# EAGLE design OpampTestBoard (EAGLE 6.5.0)
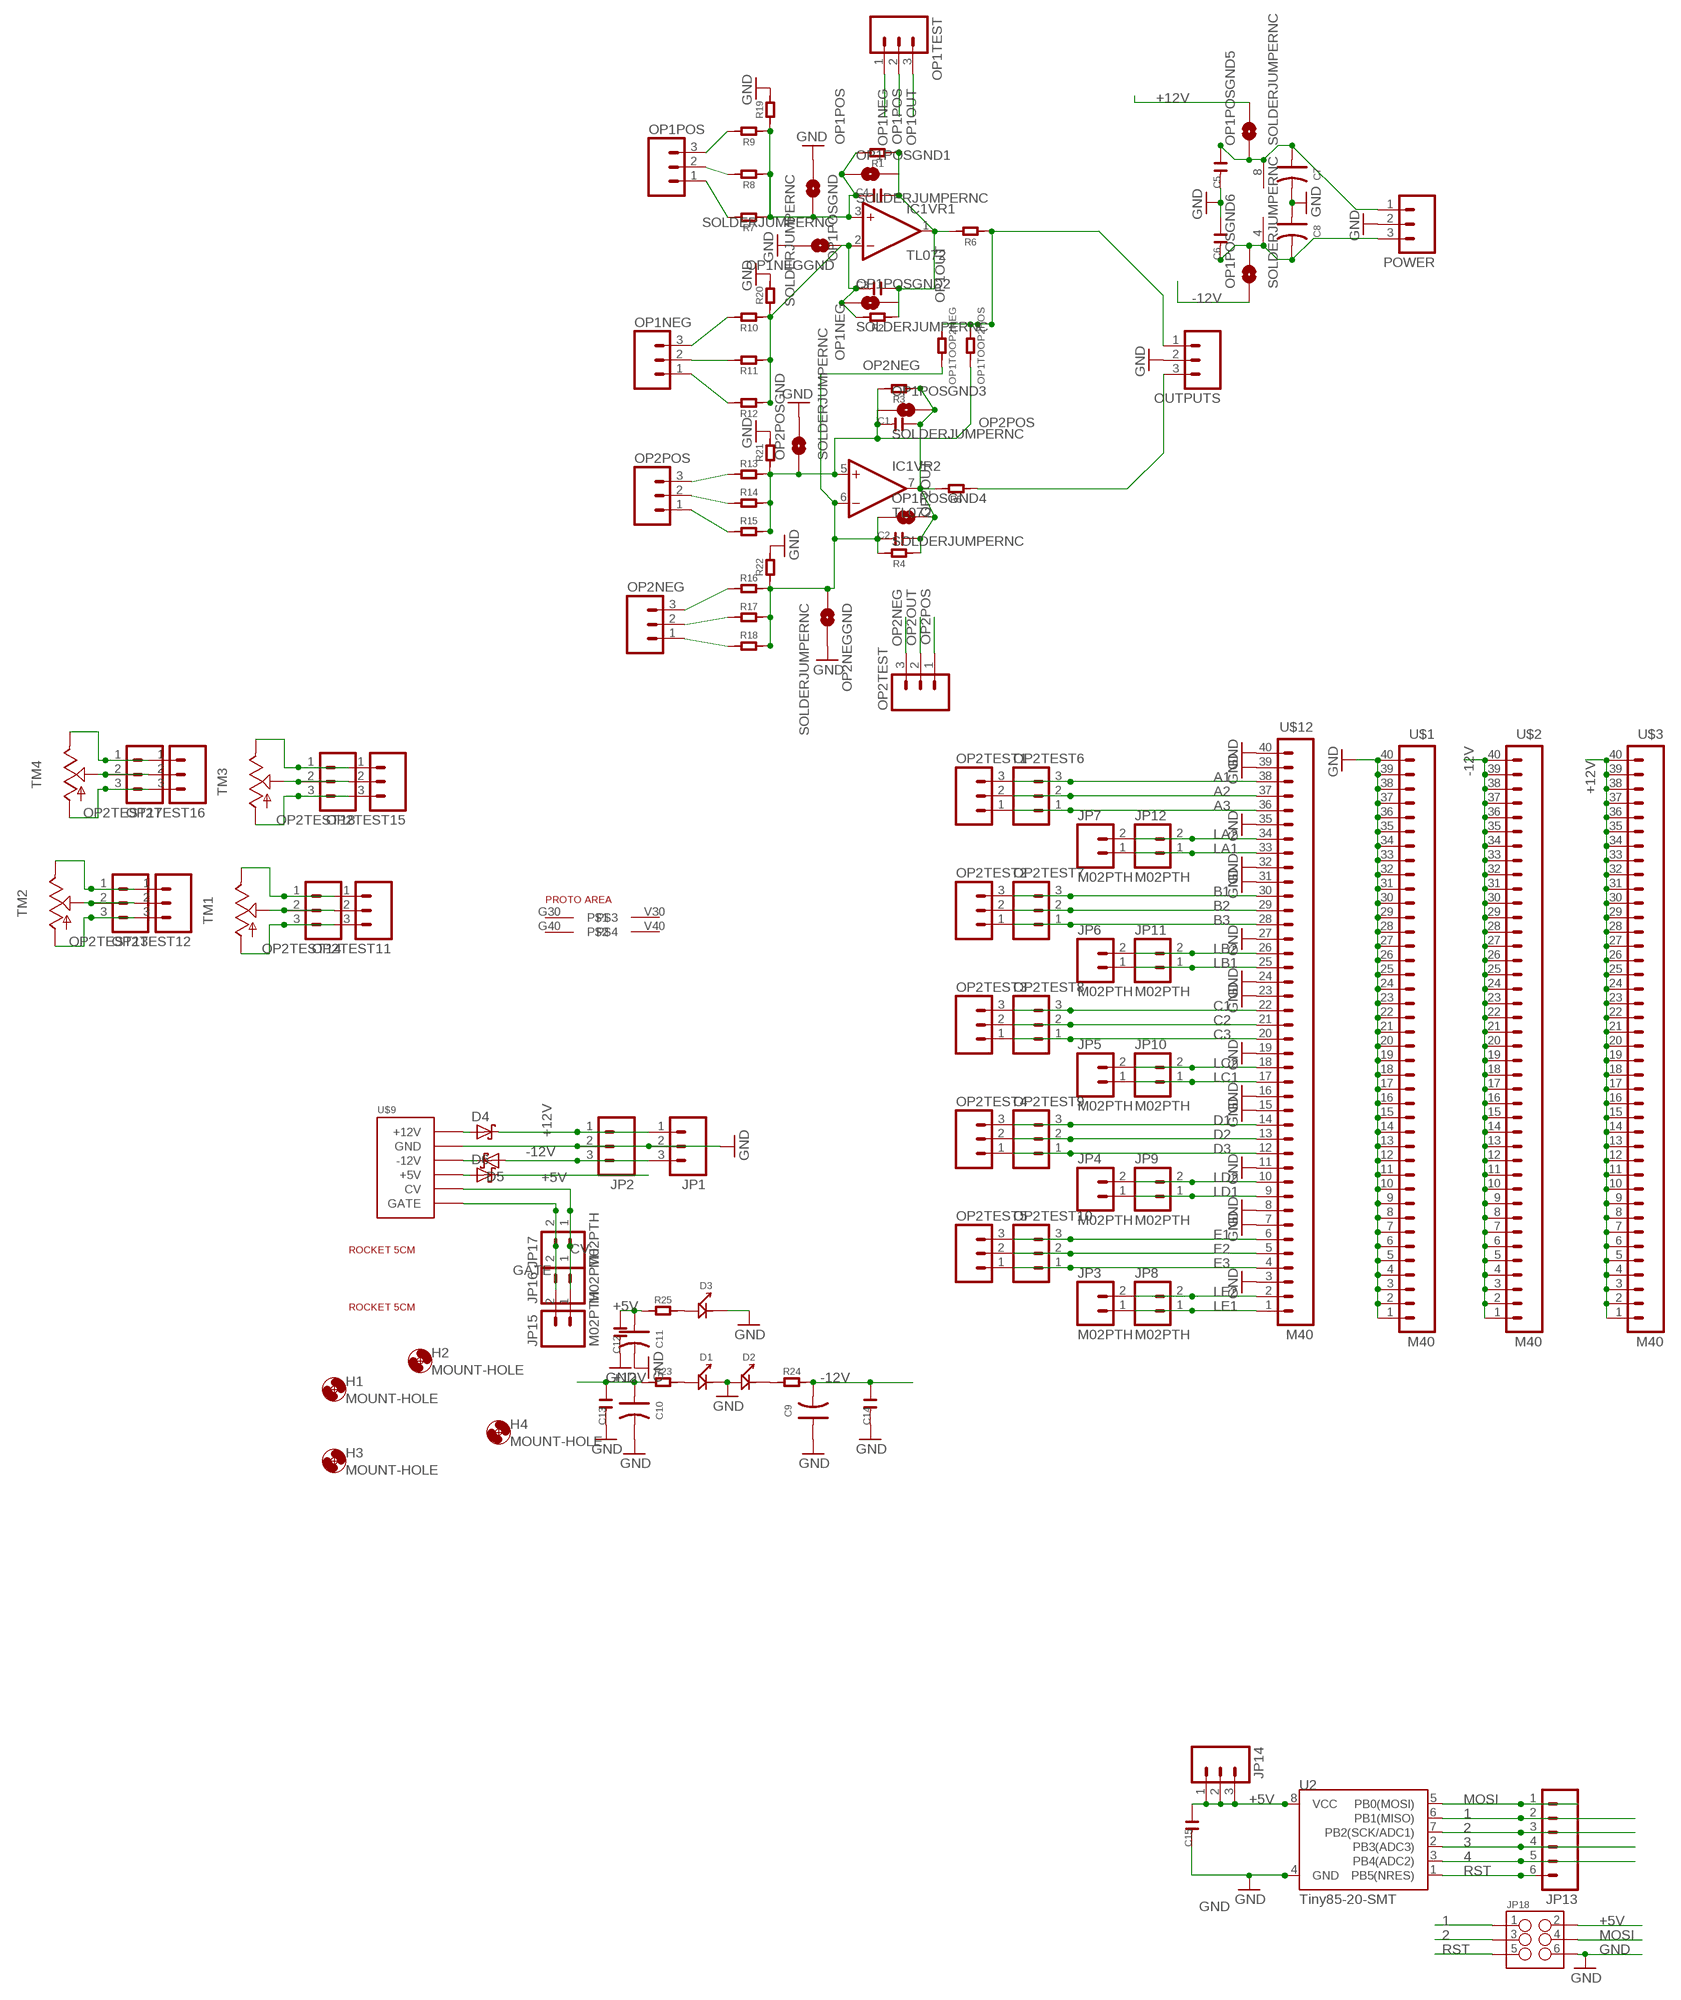
[diagram p0: schematic, sheet 1]

## Parts
C1  C-0805  [C0805]
C2  C-0805  [C0805]
C3  C-0805  [C0805]
C4  C-0805  [C0805]
C5  C-0805  [C0805]
C6  C-0805  [C0805]
C7  C-POLAR-A  [AVX-A]
C8  C-POLAR-A  [AVX-A]
C9  C-POLAR-A  [AVX-A]
C10  C-POLAR-A  [AVX-A]
C11  C-POLAR-A  [AVX-A]
C12  C-0805  [C0805]
C13  C-0805  [C0805]
C14  C-0805  [C0805]
C15  C-0603  [C0603]
D1  LED  [LED0603]
D2  LED  [LED0603]
D3  LED  [LED0603]
D4  SCHOTTKY-DIODEDO41  [DO41-10]
D5  SCHOTTKY-DIODEDO41  [DO41-10]
D6  SCHOTTKY-DIODEDO41  [DO41-10]
H1  MOUNT-HOLE  [3.2-NOMARKINGS-SMALLSAFEZONE]
H2  MOUNT-HOLE  [3.2-NOMARKINGS-SMALLSAFEZONE]
H3  MOUNT-HOLE  [3.2-NOMARKINGS-SMALLSAFEZONE]
H4  MOUNT-HOLE  [3.2-NOMARKINGS-SMALLSAFEZONE]
IC1  TL072  [SO08]
JP1  M03PTH  [1X03]
JP2  M03PTH  [1X03]
JP3  M02PTH  [1X02]
JP4  M02PTH  [1X02]
JP5  M02PTH  [1X02]
JP6  M02PTH  [1X02]
JP7  M02PTH  [1X02]
JP8  M02PTH  [1X02]
JP9  M02PTH  [1X02]
JP10  M02PTH  [1X02]
JP11  M02PTH  [1X02]
JP12  M02PTH  [1X02]
JP13  M06SIP  [1X06]
JP14  M03PTH  [1X03]
JP15  M02PTH  [1X02]
JP16  M02PTH  [1X02]
JP17  M02PTH  [1X02]
JP18  M03X2SMT  [2X3_SMT_POSTS]
OP1NEG  M03PTH  [1X03]
OP1NEGGND  SOLDERJUMPERNC  [SJ_2S]
OP1POS  M03PTH  [1X03]
OP1POSGND  SOLDERJUMPERNC  [SJ_2S]
OP1POSGND1  SOLDERJUMPERNC  [SJ_2S]
OP1POSGND2  SOLDERJUMPERNC  [SJ_2S]
OP1POSGND3  SOLDERJUMPERNC  [SJ_2S]
OP1POSGND4  SOLDERJUMPERNC  [SJ_2S]
OP1POSGND5  SOLDERJUMPERNC  [SJ_2S]
OP1POSGND6  SOLDERJUMPERNC  [SJ_2S]
OP1TEST  M03PTH  [1X03]
OP1TOOP2NEG  R-0603  [R0603]
OP1TOOP2POS  R-0603  [R0603]
OP2NEG  M03PTH  [1X03]
OP2NEGGND  SOLDERJUMPERNC  [SJ_2S]
OP2POS  M03PTH  [1X03]
OP2POSGND  SOLDERJUMPERNC  [SJ_2S]
OP2TEST  M03PTH  [1X03]
OP2TEST1  M03PTH  [1X03]
OP2TEST2  M03PTH  [1X03]
OP2TEST3  M03PTH  [1X03]
OP2TEST4  M03PTH  [1X03]
OP2TEST5  M03PTH  [1X03]
OP2TEST6  M03PTH  [1X03]
OP2TEST7  M03PTH  [1X03]
OP2TEST8  M03PTH  [1X03]
OP2TEST9  M03PTH  [1X03]
OP2TEST10  M03PTH  [1X03]
OP2TEST11  M03PTH  [1X03]
OP2TEST12  M03PTH  [1X03]
OP2TEST13  M03PTH  [1X03]
OP2TEST14  M03PTH  [1X03]
OP2TEST15  M03PTH  [1X03]
OP2TEST16  M03PTH  [1X03]
OP2TEST17  M03PTH  [1X03]
OP2TEST18  M03PTH  [1X03]
OUTPUTS  M03PTH  [1X03]
POWER  M03PTH  [1X03]
R1  R-0603  [R0603]
R2  R-0603  [R0603]
R3  R-0603  [R0603]
R4  R-0603  [R0603]
R5  R-0603  [R0603]
R6  R-0603  [R0603]
R7  R-0603  [R0603]
R8  R-0603  [R0603]
R9  R-0603  [R0603]
R10  R-0603  [R0603]
R11  R-0603  [R0603]
R12  R-0603  [R0603]
R13  R-0603  [R0603]
R14  R-0603  [R0603]
R15  R-0603  [R0603]
R16  R-0603  [R0603]
R17  R-0603  [R0603]
R18  R-0603  [R0603]
R19  R-0603  [R0603]
R20  R-0603  [R0603]
R21  R-0603  [R0603]
R22  R-0603  [R0603]
R23  R-0603  [R0603]
R24  R-0603  [R0603]
R25  R-0603  [R0603]
TM1  TRIM  [6MM]
TM2  TRIM  [6MM]
TM3  TRIM  [6MM]
TM4  TRIM  [6MM]
U2  Tiny85-20-SMT  ATTINY45TINY85-20-SMT  [SO08-EIAJ]
U$1  M40  [1X40]
U$2  M40  [1X40]
U$3  M40  [1X40]
U$9  POWER  [POWER_16]
U$10  ROCKET-5CM  [ROCKET-5CM]
U$12  M40  [1X40]
U$17  ROCKET-5CM  [ROCKET-5CM]
U$32  PROTOAREA  [PROTO_10_24]

## Nets
1: JP13.2 JP18.1 U2.6(PB1(MISO))
2: JP13.3 JP18.3 U2.7(PB2(SCK/ADC1))
3: JP13.4 U2.2(PB3(ADC3))
4: JP13.5 U2.3(PB4(ADC2))
+5V: C11.+ C12.2 C15.2 D6.C JP14.1 JP14.2 JP14.3 JP18.2 R25.1 U2.8(VCC)
+12V: C10.+ C13.2 D4.C JP1.1 JP2.1 OP1POSGND5.2 R23.1 U$3.1 U$3.2 U$3.3 U$3.4 U$3.5 U$3.6 U$3.7 U$3.8 U$3.9 U$3.10 U$3.11 U$3.12 U$3.13 U$3.14 U$3.15 U$3.16 U$3.17 U$3.18 U$3.19 U$3.20 U$3.21 U$3.22 U$3.23 U$3.24 U$3.25 U$3.26 U$3.27 U$3.28 U$3.29 U$3.30 U$3.31 U$3.32 U$3.33 U$3.34 U$3.35 U$3.36 U$3.37 U$3.38 U$3.39 U$3.40
-12V: C9.- C14.2 D5.A JP1.3 JP2.3 OP1POSGND6.1 R24.2 U$2.1 U$2.2 U$2.3 U$2.4 U$2.5 U$2.6 U$2.7 U$2.8 U$2.9 U$2.10 U$2.11 U$2.12 U$2.13 U$2.14 U$2.15 U$2.16 U$2.17 U$2.18 U$2.19 U$2.20 U$2.21 U$2.22 U$2.23 U$2.24 U$2.25 U$2.26 U$2.27 U$2.28 U$2.29 U$2.30 U$2.31 U$2.32 U$2.33 U$2.34 U$2.35 U$2.36 U$2.37 U$2.38 U$2.39 U$2.40
A1: OP2TEST1.3 OP2TEST6.3 U$12.38
A2: OP2TEST1.2 OP2TEST6.2 U$12.37
A3: OP2TEST1.1 OP2TEST6.1 U$12.36
B1: OP2TEST2.3 OP2TEST7.3 U$12.30
B2: OP2TEST2.2 OP2TEST7.2 U$12.29
B3: OP2TEST2.1 OP2TEST7.1 U$12.28
C1: OP2TEST3.3 OP2TEST8.3 U$12.22
C2: OP2TEST3.2 OP2TEST8.2 U$12.21
C3: OP2TEST3.1 OP2TEST8.1 U$12.20
CV: JP15.1 JP16.1 JP17.1 U$9.13(CV) U$9.14(CV)
D1: OP2TEST4.3 OP2TEST9.3 U$12.14
D2: OP2TEST4.2 OP2TEST9.2 U$12.13
D3: OP2TEST4.1 OP2TEST9.1 U$12.12
E1: OP2TEST5.3 OP2TEST10.3 U$12.6
E2: OP2TEST5.2 OP2TEST10.2 U$12.5
E3: OP2TEST5.1 OP2TEST10.1 U$12.4
GATE: JP15.2 JP16.2 JP17.2 U$9.15(GATE) U$9.16(GATE)
GND: C5.1 C6.2 C7.- C8.+ C9.+ C10.- C11.- C12.1 C13.1 C14.1 C15.1 D1.- D2.+ D3.- JP1.2 JP2.2 JP18.6 OP1NEGGND.2 OP1POSGND.1 OP2NEGGND.2 OP2POSGND.2 OUTPUTS.2 POWER.2 R19.2 R20.2 R21.2 R22.2 U2.4(GND) U$1.1 U$1.2 U$1.3 U$1.4 U$1.5 U$1.6 U$1.7 U$1.8 U$1.9 U$1.10 U$1.11 U$1.12 U$1.13 U$1.14 U$1.15 U$1.16 U$1.17 U$1.18 U$1.19 U$1.20 U$1.21 U$1.22 U$1.23 U$1.24 U$1.25 U$1.26 U$1.27 U$1.28 U$1.29 U$1.30 U$1.31 U$1.32 U$1.33 U$1.34 U$1.35 U$1.36 U$1.37 U$1.38 U$1.39 U$1.40 U$9.3(GND) U$9.4(GND) U$9.5(GND) U$9.6(GND) U$9.7(GND) U$9.8(GND) U$12.3 U$12.7 U$12.8 U$12.11 U$12.15 U$12.16 U$12.19 U$12.23 U$12.24 U$12.27 U$12.31 U$12.32 U$12.35 U$12.39 U$12.40
LA1: JP7.1 JP12.1 U$12.33
LA2: JP7.2 JP12.2 U$12.34
LB1: JP6.1 JP11.1 U$12.25
LB2: JP6.2 JP11.2 U$12.26
LC1: JP5.1 JP10.1 U$12.17
LC2: JP5.2 JP10.2 U$12.18
LD1: JP4.1 JP9.1 U$12.9
LD2: JP4.2 JP9.2 U$12.10
LE1: JP3.1 JP8.1 U$12.1
LE2: JP3.2 JP8.2 U$12.2
MOSI: JP13.1 JP18.4 U2.5(PB0(MOSI))
N$1: OP1POS.3 R9.2
N$2: OP1TOOP2NEG.1 OP1TOOP2POS.1 OUTPUTS.1 R6.1
N$3: OP1POS.2 R8.2
N$4: OUTPUTS.3 R5.1
N$5: OP2TEST11.2 OP2TEST14.2 TM1.S
N$6: OP2TEST12.2 OP2TEST13.2 TM2.S
N$7: OP1POS.1 R7.2
N$8: OP1NEG.3 R10.2
N$9: OP1NEG.2 R11.2
N$10: OP1NEG.1 R12.2
N$11: OP2POS.3 R13.1
N$12: OP2POS.2 R14.1
N$13: OP2POS.1 R15.1
N$14: OP2NEG.3 R16.1
N$15: OP2NEG.2 R17.1
N$16: OP2NEG.1 R18.1
N$17: OP2TEST12.1 OP2TEST13.1 TM2.E
N$18: D3.+ R25.2
N$19: D1.+ R23.2
N$20: D2.- R24.1
N$21: OP2TEST12.3 OP2TEST13.3 TM2.A
N$22: OP2TEST11.1 OP2TEST14.1 TM1.E
N$23: OP2TEST11.3 OP2TEST14.3 TM1.A
N$24: OP2TEST15.2 OP2TEST18.2 TM3.S
N$25: OP2TEST16.2 OP2TEST17.2 TM4.S
N$26: OP2TEST16.1 OP2TEST17.1 TM4.E
N$27: OP2TEST16.3 OP2TEST17.3 TM4.A
N$28: OP2TEST15.1 OP2TEST18.1 TM3.E
N$29: OP2TEST15.3 OP2TEST18.3 TM3.A
N$30: D4.A U$9.9(+12V) U$9.10(+12V)
N$31: D5.C U$9.1(-12V) U$9.2(-12V)
N$32: D6.A U$9.11(+5V) U$9.12(+5V)
OP1NEG: C3.1 IC1.2(VR1:-IN) OP1NEGGND.1 OP1POSGND2.1 OP1TEST.1 R2.2 R10.1 R11.1 R12.1 R20.1
OP1OUT: C3.2 C4.2 IC1.1(VR1:OUT) OP1POSGND1.2 OP1POSGND2.2 OP1TEST.3 R1.1 R2.1 R6.2
OP1POS: C4.1 IC1.3(VR1:+IN) OP1POSGND1.1 OP1POSGND.2 OP1TEST.2 R1.2 R7.1 R8.1 R9.1 R19.1
OP2NEG: C2.1 IC1.6(VR2:-IN) OP1POSGND4.1 OP1TOOP2NEG.2 OP2NEGGND.1 OP2TEST.3 R4.2 R16.2 R17.2 R18.2 R22.1
OP2OUT: C1.2 C2.2 IC1.7(VR2:OUT) OP1POSGND3.2 OP1POSGND4.2 OP2TEST.2 R3.1 R4.1 R5.2
OP2POS: C1.1 IC1.5(VR2:+IN) OP1POSGND3.1 OP1TOOP2POS.2 OP2POSGND.1 OP2TEST.1 R3.2 R13.2 R14.2 R15.2 R21.1
RST: JP13.6 JP18.5 U2.1(PB5(NRES))
VNEG: C6.1 C8.- IC1.4(VR3:V-) OP1POSGND6.2 POWER.3
VPOS: C5.2 C7.+ IC1.8(VR3:V+) OP1POSGND5.1 POWER.1
Unconnected: U$32.G30 U$32.G40 U$32.V30 U$32.V40

## Library data of the parts
C1-C6 C12-C15 = OPL:C*
C7-C11 = OPL:C-POLAR*
D1-D3 = OPL:LED*: LED
D4-D6 = adafruit:SCHOTTKY-DIODE: Schottky Diode
H1-H4 = zephod-components:MOUNT-HOLE: MOUNTING HOLE with drill center marker
IC1 = EurorackModularParts:TL072
JP1 JP2 JP14 OP1NEG OP1POS OP1TEST OP2NEG OP2POS OP2TEST OP2TEST1-OP2TEST18 OUTPUTS POWER = SparkFun-Connectors:M03: Header 3 Standard 3-pin 0.1" header. Use with straight break away headers (SKU : PRT-00116), right angle break away headers (PRT-00553), swiss pins (PRT-00743), machine pins (PRT-00117), and female headers (PRT-00115). Molex polarized connector foot print use with SKU : PRT-08232 with associated crimp pins and housings.
JP3-JP12 JP15-JP17 = SparkFun-Connectors:M02: Standard 2-pin 0.1" header. Use with - straight break away headers ( PRT-00116) - right angle break away headers (PRT-00553) - swiss pins (PRT-00743) - machine pins (PRT-00117) - female headers (PRT-00115) Molex polarized connector foot print use with: PRT-08233 with associated crimp pins and housings. 2.54_SCREWTERM for use with PRT-10571. 3.5mm Screw Terminal footprints for PRT-08084 5mm Screw Terminal footprints for use with PRT-08433
JP13 = zephod-components:M06: Header 6 Standard 6-pin 0.1" header. Use with straight break away headers (SKU : PRT-00116), right angle break away headers (PRT-00553), swiss pins (PRT-00743), machine pins (PRT-00117), and female headers (PRT-00115). Molex polarized connector foot print use with SKU : PRT-08094 with associated crimp pins and housings. NOTES ON THE VARIANTS LOCK and LOCK_LONGPADS... This footprint was designed to help hold the alignment of a through-hole component (i.e. 6-pin header) while soldering it into place. You may notice that each hole has been shifted either up or down by 0.005 of an inch from it's more standard position (which is a perfectly straight line). This slight alteration caused the pins (the squares in the middle) to touch the edges of the holes. Because they are alternating, it causes a "brace" to hold the component in place. 0.005 has proven to be the perfect amount of "off-center" position when using our standard breakaway headers. Although looks a little odd when you look at the bare footprint, once you have a header in there, the alteration is very hard to notice. Also,if you push a header all the way into place, it is covered up entirely on the bottom side. This idea of altering the position of holes to aid alignment will be further integrated into the Sparkfun Library for other footprints. It can help hold any component with 3 or more connection pins.
JP18 = zephod-components:M03X2: 2x3 .1" header. Shrouded, with keying- CONN-10681 SMT- CONN-11415 Pogo pins- HW-11044; PROD_ID: CONN-11415
OP1NEGGND OP1POSGND OP1POSGND1-OP1POSGND6 OP2NEGGND OP2POSGND = SparkFun-Passives:SOLDERJUMPER: Solder Jumper Standard SMD solder jumper. Used to automate production. Two varients : Normally Open and Normally Closed are the same, but have different paste layers. NC will have a large amount of paste and should jumper during reflow.
OP1TOOP2NEG OP1TOOP2POS R1-R25 = OPL:R*
TM1-TM4 = adafruit:TRIM
U2 = SparkFun-DigitalIC:ATTINY45: Atmel 8-pin 2/4/8kB flash uC; PROD_ID: IC-09092
U$1-U$3 U$12 = SparkFun-Connectors:M40: 1x40 .1" header
U$9 = EurorackModularParts:POWER
U$10 U$17 = zephod-components:ROCKET-5CM
U$32 = DP_protoboard:PROTOAREA

## Net classes
0 default: width 0.381 mm
1 POWER: width 0.406 mm

## Board
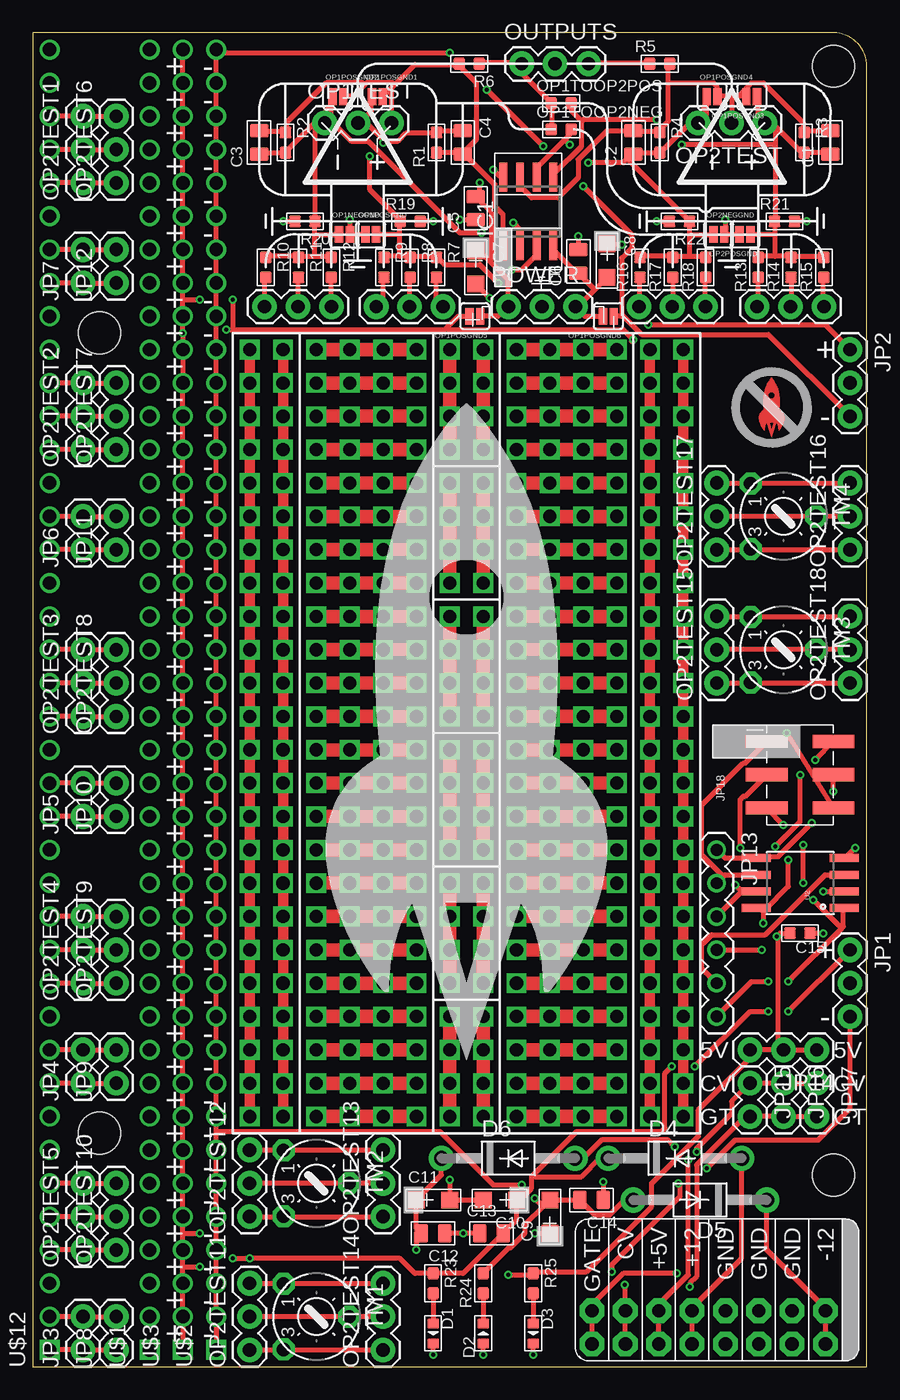
[diagram p1: board, top side]
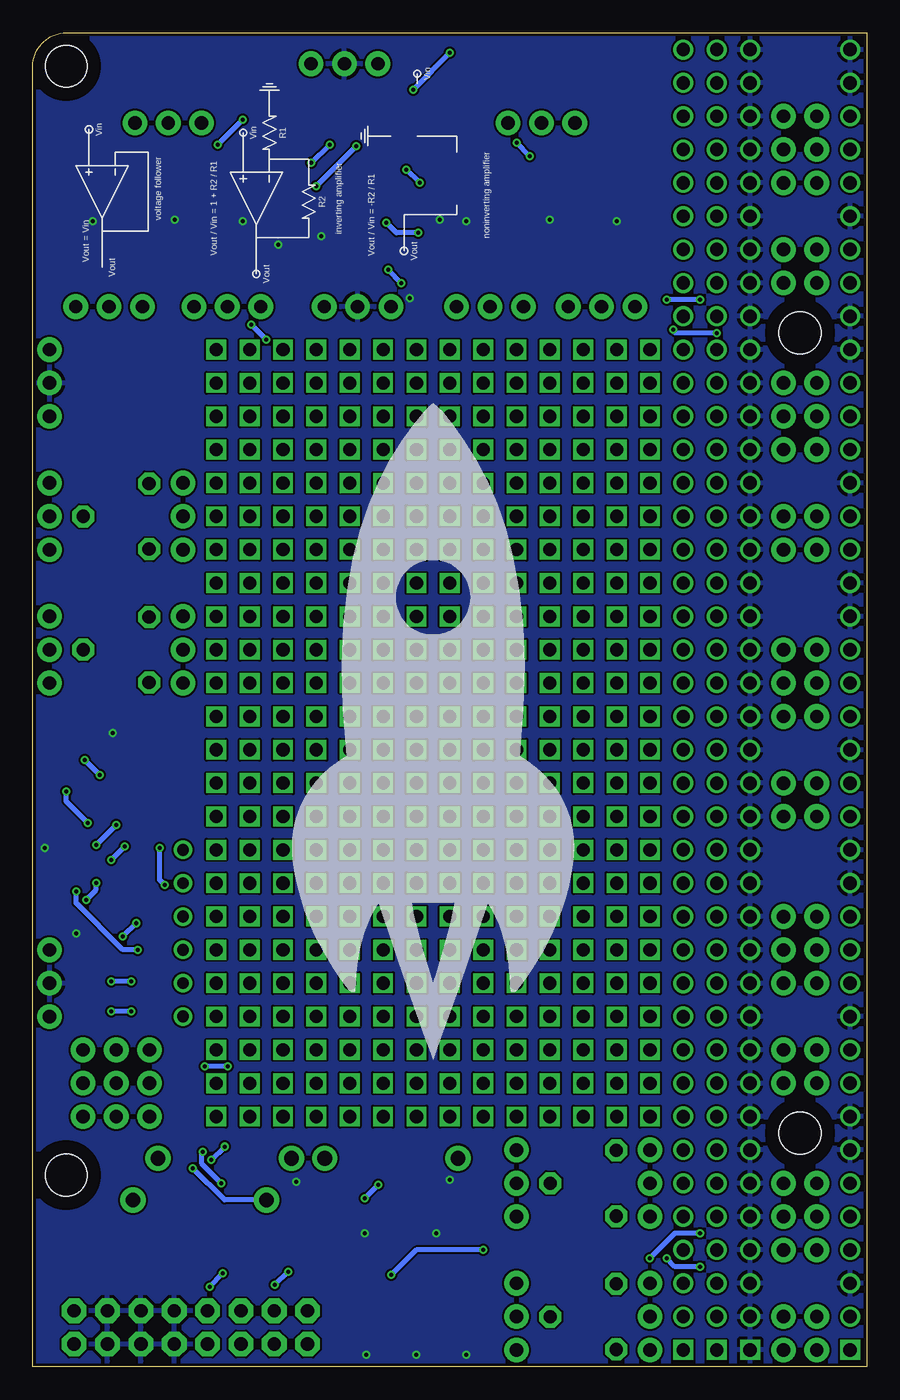
[diagram p2: board, bottom side, seen from below]

Size 63.5 x 101.6 mm. Coordinates in mm from the lower left corner, seen from the top.
Outline: 0,0 63.5,0 63.5,99.06 arc90 60.96,101.6 0,101.6 0,0
Copper layers (1*16): Top 0.035mm / dielectric 1.5mm / Bottom 0.035mm
Design rules "ITEADstudio_DRC": minimum track width 6mil, minimum drill 12mil, track to track 6mil, track to pad 6mil, pad to pad 6mil, via to via 6mil, smd to smd 0mil, copper to edge 10mil, drill to drill 10mil, minimum pad ring 10mil, minimum via ring 6mil, stop-mask expansion 2mil, vias tented up to drill 100mil, thermal gap 10mil

### Footprints (pad centres in the part's own frame; a part is rotated, then mirrored left to right if it is on the bottom)
C0805 = smd 1.016 x 1.397: 1 -0.889,0; 2 0.889,0
AVX-A = smd 1.27 x 1.27: + -1.27,0; - 1.27,0
C0603 = smd 0.889 x 0.889: 1 -0.762,0; 2 0.762,0
LED0603 = smd 0.762 x 0.889: + -0.762,0; - 0.762,0
DO41-10 = drill 1.118 pad 1.93: A 5.08,0; C -5.08,0
3.2-NOMARKINGS-SMALLSAFEZONE = hole 3.2: 0,0
SO08 = smd 0.6 x 2.2: 1 -1.905,-2.6; 2 -0.635,-2.6; 3 0.635,-2.6; 4 1.905,-2.6; 5 1.905,2.6; 6 0.635,2.6; 7 -0.635,2.6; 8 -1.905,2.6
1X03 = drill 1.016 pad 1.88: 1 0,0; 2 2.54,0; 3 5.08,0
1X02 = drill 1.016 pad 1.88: 1 0,0; 2 2.54,0
1X06 = drill 0.9: 1 0,0; 2 2.54,0; 3 5.08,0; 4 7.62,0; 5 10.16,0; 6 12.7,0
2X3_SMT_POSTS = smd 1 x 3.17: 1 -2.54,-2.54; 2 -2.54,2.54; 3 0,-2.54; 4 0,2.54; 5 2.54,-2.54; 6 2.54,2.54
SJ_2S = smd 0.635 x 1.27: 1 -0.412,0; 2 0.412,0
R0603 = smd 0.889 x 0.889: 1 -0.762,0; 2 0.762,0
6MM = drill 1 pad 1.676 octagon: A -2.5,-2.5; E 2.5,-2.5; S 0,2.5
SO08-EIAJ = smd 0.61 x 2.21: 1 -1.905,-3.378; 2 -0.635,-3.378; 3 0.635,-3.378; 4 1.905,-3.378; 5 1.905,3.353; 6 0.635,3.353; 7 -0.635,3.353; 8 -1.905,3.353
1X40 = drill 1.016 square: 1 -49.53,0 | drill 1.016: 2 -46.99,0; 3 -44.45,0; 4 -41.91,0; 5 -39.37,0; 6 -36.83,0; 7 -34.29,0; 8 -31.75,0; 9 -29.21,0; 10 -26.67,0; 11 -24.13,0; 12 -21.59,0; 13 -19.05,0; 14 -16.51,0; 15 -13.97,0; 16 -11.43,0; 17 -8.89,0; 18 -6.35,0; 19 -3.81,0; 20 -1.27,0; 21 1.27,0; 22 3.81,0; 23 6.35,0; 24 8.89,0; 25 11.43,0; 26 13.97,0; 27 16.51,0; 28 19.05,0; 29 21.59,0; 30 24.13,0; 31 26.67,0; 32 29.21,0; 33 31.75,0; 34 34.29,0; 35 36.83,0; 36 39.37,0; 37 41.91,0; 38 44.45,0; 39 46.99,0; 40 49.53,0
POWER_16 = drill 1.016 pad 1.88 octagon: 1 -6.35,-1.27; 2 -6.35,1.27; 3 -3.81,-1.27; 4 -3.81,1.27; 5 -1.27,-1.27; 6 -1.27,1.27; 7 1.27,-1.27; 8 1.27,1.27; 9 3.81,-1.27; 10 3.81,1.27; 11 6.35,-1.27; 12 6.35,1.27; 13 8.89,-1.27; 14 8.89,1.27; 15 11.43,-1.27; 16 11.43,1.27
PROTO_10_24 = drill 1 square: 1 -29.21,-11.43; 2 -26.67,-11.43; 3 -24.13,-11.43; 4 -21.59,-11.43; 5 -19.05,-11.43; 6 -16.51,-11.43; 7 -13.97,-11.43; 8 -11.43,-11.43; 9 -8.89,-11.43; 10 -6.35,-11.43; 11 -3.81,-11.43; 12 -1.27,-11.43; 13 1.27,-11.43; 14 3.81,-11.43; 15 6.35,-11.43; 16 8.89,-11.43; 17 11.43,-11.43; 18 13.97,-11.43; 19 16.51,-11.43; 20 19.05,-11.43; 21 21.59,-11.43; 22 24.13,-11.43; 23 26.67,-11.43; 24 29.21,-11.43; 25 -29.21,-8.89; 26 -26.67,-8.89; 27 -24.13,-8.89; 28 -21.59,-8.89; 29 -19.05,-8.89; 30 -16.51,-8.89; 31 -13.97,-8.89; 32 -11.43,-8.89; 33 -8.89,-8.89; 34 -6.35,-8.89; 35 -3.81,-8.89; 36 -1.27,-8.89; 37 1.27,-8.89; 38 3.81,-8.89; 39 6.35,-8.89; 40 8.89,-8.89; 41 11.43,-8.89; 42 13.97,-8.89; 43 16.51,-8.89; 44 19.05,-8.89; 45 21.59,-8.89; 46 24.13,-8.89; 47 26.67,-8.89; 48 29.21,-8.89; 49 -29.21,-6.35; 50 -26.67,-6.35; 51 -24.13,-6.35; 52 -21.59,-6.35; 53 -19.05,-6.35; 54 -16.51,-6.35; 55 -13.97,-6.35; 56 -11.43,-6.35; 57 -8.89,-6.35; 58 -6.35,-6.35; 59 -3.81,-6.35; 60 -1.27,-6.35; 61 1.27,-6.35; 62 3.81,-6.35; 63 6.35,-6.35; 64 8.89,-6.35; 65 11.43,-6.35; 66 13.97,-6.35; 67 16.51,-6.35; 68 19.05,-6.35; 69 21.59,-6.35; 70 24.13,-6.35; 71 26.67,-6.35; 72 29.21,-6.35; 73 -29.21,-3.81; 74 -26.67,-3.81; 75 -24.13,-3.81; 76 -21.59,-3.81; 77 -19.05,-3.81; 78 -16.51,-3.81; 79 -13.97,-3.81; 80 -11.43,-3.81; 81 -8.89,-3.81; 82 -6.35,-3.81; 83 -3.81,-3.81; 84 -1.27,-3.81; 85 1.27,-3.81; 86 3.81,-3.81; 87 6.35,-3.81; 88 8.89,-3.81; 89 11.43,-3.81; 90 13.97,-3.81; 91 16.51,-3.81; 92 19.05,-3.81; 93 21.59,-3.81; 94 24.13,-3.81; 95 26.67,-3.81; 96 29.21,-3.81; 97 -29.21,-1.27; 98 -26.67,-1.27; 99 -24.13,-1.27; 100 -21.59,-1.27; 101 -19.05,-1.27; 102 -16.51,-1.27; 103 -13.97,-1.27; 104 -11.43,-1.27; 105 -8.89,-1.27; 106 -6.35,-1.27; 107 -3.81,-1.27; 108 -1.27,-1.27; 109 1.27,-1.27; 110 3.81,-1.27; 111 6.35,-1.27; 112 8.89,-1.27; 113 11.43,-1.27; 114 13.97,-1.27; 115 16.51,-1.27; 116 19.05,-1.27; 117 21.59,-1.27; 118 24.13,-1.27; 119 26.67,-1.27; 120 29.21,-1.27; 121 -29.21,1.27; 122 -26.67,1.27; 123 -24.13,1.27; 124 -21.59,1.27; 125 -19.05,1.27; 126 -16.51,1.27; 127 -13.97,1.27; 128 -11.43,1.27; 129 -8.89,1.27; 130 -6.35,1.27; 131 -3.81,1.27; 132 -1.27,1.27; 133 1.27,1.27; 134 3.81,1.27; 135 6.35,1.27; 136 8.89,1.27; 137 11.43,1.27; 138 13.97,1.27; 139 16.51,1.27; 140 19.05,1.27; 141 21.59,1.27; 142 24.13,1.27; 143 26.67,1.27; 144 29.21,1.27; 145 -29.21,3.81; 146 -26.67,3.81; 147 -24.13,3.81; 148 -21.59,3.81; 149 -19.05,3.81; 150 -16.51,3.81; 151 -13.97,3.81; 152 -11.43,3.81; 153 -8.89,3.81; 154 -6.35,3.81; 155 -3.81,3.81; 156 -1.27,3.81; 157 1.27,3.81; 158 3.81,3.81; 159 6.35,3.81; 160 8.89,3.81; 161 11.43,3.81; 162 13.97,3.81; 163 16.51,3.81; 164 19.05,3.81; 165 21.59,3.81; 166 24.13,3.81; 167 26.67,3.81; 168 29.21,3.81; 169 -29.21,6.35; 170 -26.67,6.35; 171 -24.13,6.35; 172 -21.59,6.35; 173 -19.05,6.35; 174 -16.51,6.35; 175 -13.97,6.35; 176 -11.43,6.35; 177 -8.89,6.35; 178 -6.35,6.35; 179 -3.81,6.35; 180 -1.27,6.35; 181 1.27,6.35; 182 3.81,6.35; 183 6.35,6.35; 184 8.89,6.35; 185 11.43,6.35; 186 13.97,6.35; 187 16.51,6.35; 188 19.05,6.35; 189 21.59,6.35; 190 24.13,6.35; 191 26.67,6.35; 192 29.21,6.35; 193 -29.21,8.89; 194 -26.67,8.89; 195 -24.13,8.89; 196 -21.59,8.89; 197 -19.05,8.89; 198 -16.51,8.89; 199 -13.97,8.89; 200 -11.43,8.89; 201 -8.89,8.89; 202 -6.35,8.89; 203 -3.81,8.89; 204 -1.27,8.89; 205 1.27,8.89; 206 3.81,8.89; 207 6.35,8.89; 208 8.89,8.89; 209 11.43,8.89; 210 13.97,8.89; 211 16.51,8.89; 212 19.05,8.89; 213 21.59,8.89; 214 24.13,8.89; 215 26.67,8.89; 216 29.21,8.89; 217 -29.21,11.43; 218 -26.67,11.43; 219 -24.13,11.43; 220 -21.59,11.43; 221 -19.05,11.43; 222 -16.51,11.43; 223 -13.97,11.43; 224 -11.43,11.43; 225 -8.89,11.43; 226 -6.35,11.43; 227 -3.81,11.43; 228 -1.27,11.43; 229 1.27,11.43; 230 3.81,11.43; 231 6.35,11.43; 232 8.89,11.43; 233 11.43,11.43; 234 13.97,11.43; 235 16.51,11.43; 236 19.05,11.43; 237 21.59,11.43; 238 24.13,11.43; 239 26.67,11.43; 240 29.21,11.43; G30 -29.21,13.97; G31 -26.67,13.97; G32 -24.13,13.97; G33 -21.59,13.97; G34 -19.05,13.97; G35 -16.51,13.97; G36 -13.97,13.97; G37 -11.43,13.97; G38 -8.89,13.97; G39 -6.35,13.97; G40 -29.21,-13.97; G41 -26.67,-13.97; G42 -24.13,-13.97; G43 -21.59,-13.97; G44 -19.05,-13.97; G45 -16.51,-13.97; G46 -13.97,-13.97; G47 -11.43,-13.97; G48 -8.89,-13.97; G49 -6.35,-13.97; G310 -3.81,13.97; G311 -1.27,13.97; G312 1.27,13.97; G313 3.81,13.97; G314 6.35,13.97; G315 8.89,13.97; G316 11.43,13.97; G317 13.97,13.97; G318 16.51,13.97; G319 19.05,13.97; G320 21.59,13.97; G321 24.13,13.97; G322 26.67,13.97; G323 29.21,13.97; G410 -3.81,-13.97; G411 -1.27,-13.97; G412 1.27,-13.97; G413 3.81,-13.97; G414 6.35,-13.97; G415 8.89,-13.97; G416 11.43,-13.97; G417 13.97,-13.97; G418 16.51,-13.97; G419 19.05,-13.97; G420 21.59,-13.97; G421 24.13,-13.97; G422 26.67,-13.97; G423 29.21,-13.97; V30 -29.21,16.51; V31 -26.67,16.51; V32 -24.13,16.51; V33 -21.59,16.51; V34 -19.05,16.51; V35 -16.51,16.51; V36 -13.97,16.51; V37 -11.43,16.51; V38 -8.89,16.51; V39 -6.35,16.51; V40 -29.21,-16.51; V41 -26.67,-16.51; V42 -24.13,-16.51; V43 -21.59,-16.51; V44 -19.05,-16.51; V45 -16.51,-16.51; V46 -13.97,-16.51; V47 -11.43,-16.51; V48 -8.89,-16.51; V49 -6.35,-16.51; V310 -3.81,16.51; V311 -1.27,16.51; V312 1.27,16.51; V313 3.81,16.51; V314 6.35,16.51; V315 8.89,16.51; V316 11.43,16.51; V317 13.97,16.51; V318 16.51,16.51; V319 19.05,16.51; V320 21.59,16.51; V321 24.13,16.51; V322 26.67,16.51; V323 29.21,16.51; V410 -3.81,-16.51; V411 -1.27,-16.51; V412 1.27,-16.51; V413 3.81,-16.51; V414 6.35,-16.51; V415 8.89,-16.51; V416 11.43,-16.51; V417 13.97,-16.51; V418 16.51,-16.51; V419 19.05,-16.51; V420 21.59,-16.51; V421 24.13,-16.51; V422 26.67,-16.51; V423 29.21,-16.51

### Placement (x,y rotation side)
C1  60.73,93.24 90 top
C2  45.73,93.24 90 top
C3  17.23,93.24 90 top
C4  32.73,93.24 270 top
C5  33.73,88.24 90 top
C6  41.54,84.19 90 top
C7  33.73,83.74 270 top
C8  43.73,84.24 270 top
C9  39.37,11.43 90 top
C10  35.56,12.7 180 top
C11  30.48,12.7 0 top
C12  30.48,10.16 180 top
C13  34.92,10.16 0 top
C14  42.55,12.7 180 top
C15  58.42,33.02 180 top
D1  30.48,2.54 270 top
D2  34.29,2.54 90 top
D3  38.1,2.54 270 top
D4  48.9,15.88 0 top
D5  50.8,12.7 180 top
D6  36.2,15.88 0 top
H1  5.08,78.74 0 top
H2  5.08,17.78 0 top
H3  60.96,14.61 0 top
H4  60.96,99.06 0 top
IC1  37.73,87.99 0 top
JP1  62.23,31.75 270 top
JP2  62.23,77.47 270 top
JP3  3.81,1.27 90 top
JP4  3.81,21.59 90 top
JP5  3.81,41.91 90 top
JP6  3.81,62.23 90 top
JP7  3.81,82.55 90 top
JP8  6.35,1.27 90 top
JP9  6.35,21.59 90 top
JP10  6.35,41.91 90 top
JP11  6.35,62.23 90 top
JP12  6.35,82.55 90 top
JP13  52.07,39.37 270 top
JP14  59.69,24.13 180 top
JP15  54.61,21.59 270 top
JP16  57.15,21.59 270 top
JP17  59.69,21.59 270 top
JP18  58.42,45.09 270 top
OP1NEG  22.73,80.74 180 top
OP1NEGGND  23.73,86.24 0 top
OP1POS  31.23,80.74 180 top
OP1POSGND  25.73,86.24 0 top
OP1POSGND1  26.23,96.74 0 top
OP1POSGND2  23.23,96.74 0 top
OP1POSGND3  54.73,96.74 180 top
OP1POSGND4  51.73,96.74 0 top
OP1POSGND5  33.66,80.01 180 top
OP1POSGND6  43.82,80.01 180 top
OP1TEST  22.23,94.74 0 top
OP1TOOP2NEG  40.23,94.24 0 top
OP1TOOP2POS  40.23,96.24 0 top
OP2NEG  51.23,80.74 180 top
OP2NEGGND  52.23,86.24 0 top
OP2POS  60.23,80.74 180 top
OP2POSGND  54.23,86.24 180 top
OP2TEST  55.73,94.74 180 top
OP2TEST1  3.81,90.17 90 top
OP2TEST2  3.81,69.85 90 top
OP2TEST3  3.81,49.53 90 top
OP2TEST4  3.81,29.21 90 top
OP2TEST5  3.81,8.89 90 top
OP2TEST6  6.35,90.17 90 top
OP2TEST7  6.35,69.85 90 top
OP2TEST8  6.35,49.53 90 top
OP2TEST9  6.35,29.21 90 top
OP2TEST10  6.35,8.89 90 top
OP2TEST11  16.51,1.27 90 top
OP2TEST12  16.51,11.43 90 top
OP2TEST13  26.67,11.43 90 top
OP2TEST14  26.67,1.27 90 top
OP2TEST15  52.07,52.07 90 top
OP2TEST16  62.23,62.23 90 top
OP2TEST17  52.07,62.23 90 top
OP2TEST18  62.23,52.07 90 top
OUTPUTS  37.23,99.24 0 top
POWER  36.23,80.74 0 top
R1  30.73,93.24 90 top
R2  19.23,93.24 270 top
R3  58.73,93.24 270 top
R4  47.73,93.24 270 top
R5  47.73,99.24 0 top
R6  33.23,99.24 180 top
R7  30.73,83.74 270 top
R8  28.73,83.74 270 top
R9  26.73,83.74 270 top
R10  17.73,83.74 270 top
R11  20.23,83.74 270 top
R12  22.73,83.74 270 top
R13  55.23,83.74 90 top
R14  57.73,83.74 90 top
R15  60.23,83.74 90 top
R16  46.23,83.74 90 top
R17  48.73,83.74 90 top
R18  51.23,83.74 90 top
R19  28.73,87.24 0 top
R20  20.73,87.24 180 top
R21  57.23,87.24 0 top
R22  49.23,87.24 180 top
R23  30.48,6.35 270 top
R24  34.29,6.35 90 top
R25  38.1,6.35 270 top
TM1  21.59,3.81 270 top
TM2  21.59,13.97 270 top
TM3  57.15,54.61 270 top
TM4  57.15,64.77 270 top
U2  58.42,36.83 90 top
U$1  8.89,50.8 90 top
U$2  13.97,50.8 90 top
U$3  11.43,50.8 90 top
U$4  SYMBOLSOPAMP  [SYMB_OPAMP]  46.48,90.99 270 bottom
U$5  R2  [RESISTOR]  42.48,88.74 270 bottom
U$6  R1  [RESISTOR]  45.48,93.99 270 bottom
U$7  SYMBOLSOPAMP  [SYMB_OPAMP]  58.23,91.49 270 bottom
U$8  [SMALLROCKET]  55.95,72.76 0 top
U$9  54.01,2.99 180 top
U$10  33.02,46.36 0 bottom
U$12  1.27,50.8 90 top
U$17  33.02,46.36 0 top
U$32  33.02,48.26 90 top

### Tracks (layer width: path | path; a pad name or v marks a point on that pad's centre or on a via)
1
  Top 0.381: U2.6 52.71,37.47 52.58,37.34 | JP13.2 52.58,37.34 | JP18.1 54.23,45.97 54.1,45.97 50.93,42.8 50.93,38.99 52.58,37.34
2  (via drill 0.3)
  Top 0.381: 53.98,36.2 U2.7 | JP13.3 53.98,36.2 | JP18.3 54.23,43.43 54.1,43.43 53.85,43.18 v53.85,39.5 | 53.98,36.2 v53.47,36.7
  Bottom 0.381: v53.85,39.5 53.85,37.08 v53.47,36.7
3  (via drill 0.3)
  Top 0.381: v60.2,36.2 U2.2 | JP13.4 v55.5,31.75
  Bottom 0.381: v60.2,36.2 60.2,35.31 56.64,31.75 v55.5,31.75
4
  Top 0.381: U2.3 60.33,37.47 55.75,32.89 51.69,32.89 50.93,32.13 50.93,30.35 JP13.5
+5V  (via drill 0.3)
  Top 0.381: D6.C 31.11,14.61 C11.+ 29.21,10.54 C12.2 29.21,10.16 v29.21,8.89 | C15.2 56.9,33.02 v56.64,32.77 56.77,32.64 56.77,24.51 JP14.2 | v55.63,33.78 55.63,34.67 U2.8 55.75,34.8 57.53,36.58 v57.53,38.61 | JP14.2 JP14.3 54.48,24 54.48,23.37 50.67,19.56 50.67,17.53 47.12,13.97 47.12,12.19 42.16,7.24 38.23,7.24 R25.1 37.97,6.98 v36.2,6.98 | JP14.2 JP14.1 | v59.56,46.23 JP18.2 | v58.42,45.09 58.42,41.53 v56.52,39.62
  Bottom 0.381: v55.63,33.78 v56.64,32.77 | v58.42,45.09 v59.56,46.23 | v57.53,38.61 v56.52,39.62 | v29.21,8.89 34.29,8.89 v36.2,6.98
+12V  (via drill 0.3)
  Top 0.381: U$3.1 U$3.2 U$3.3 11.43,7.62 | 11.43,7.62 U$3.4 11.43,10.16 | 11.43,10.16 U$3.5 U$3.6 U$3.7 U$3.8 U$3.9 U$3.10 U$3.11 U$3.12 U$3.13 U$3.14 U$3.15 U$3.16 U$3.17 U$3.18 U$3.19 U$3.20 U$3.21 U$3.22 U$3.23 U$3.24 U$3.25 U$3.26 U$3.27 U$3.28 U$3.29 U$3.30 U$3.31 v11.43,78.74 U$3.32 11.43,81.28 | v57.53,27.05 JP1.1 | v56.01,27.05 54.61,27.05 v50.42,22.86 | v48.64,22.86 48.13,22.35 48.13,18.16 47.88,17.91 41.4,17.91 38.1,14.61 | 38.1,14.61 37.97,14.48 37.97,13.59 36.96,12.57 C10.+ 36.83,11.18 C13.2 32.77,7.11 R23.1 29.08,7.11 27.94,8.26 v16.51,8.26 v15.24,8.26 | D4.C 43.18,15.88 41.78,14.48 38.23,14.48 38.1,14.61 | OP1POSGND5.2 32.38,80.01 31.5,79.12 | 31.5,79.12 31.37,78.99 15.24,78.99 | v14.73,78.99 15.24,78.99 | 11.43,81.28 U$3.33 U$3.34 U$3.35 U$3.36 U$3.37 U$3.38 U$3.39 U$3.40 | v46.86,79.38 60.33,79.38 JP2.1 | 31.5,79.12 31.62,78.99 44.96,78.99 v45.72,78.23 45.59,78.1 | 11.43,81.28 v12.7,81.28 | v15.24,81.28 15.24,78.99 | 11.43,10.16 v12.7,10.16 | 11.43,7.62 v12.7,7.62
  Bottom 0.381: v56.01,27.05 v57.53,27.05 | v48.64,22.86 v50.42,22.86 | v14.73,78.99 14.61,78.74 v11.43,78.74 | v45.72,78.23 v46.86,79.38 | v12.7,81.28 v15.24,81.28 | v12.7,10.16 14.61,10.16 v16.51,8.26 | v12.7,7.62 14.61,7.62 v15.24,8.26
-12V  (via drill 0.3)
  Top 0.381: R24.2 36.2,9.02 36.32,9.02 37.47,10.16 37.47,10.79 38.86,12.19 | 38.86,12.19 C9.- C14.2 42.8,11.56 43.94,11.56 45.09,12.7 D5.A | U$2.1 U$2.2 U$2.3 U$2.4 U$2.5 U$2.6 U$2.7 13.97,17.91 | 13.97,17.91 U$2.8 U$2.9 U$2.10 U$2.11 U$2.12 U$2.13 U$2.14 U$2.15 U$2.16 U$2.17 U$2.18 U$2.19 U$2.20 U$2.21 U$2.22 U$2.23 U$2.24 U$2.25 U$2.26 U$2.27 U$2.28 U$2.29 U$2.30 U$2.31 U$2.32 U$2.33 U$2.34 U$2.35 U$2.36 U$2.37 U$2.38 U$2.39 U$2.40 14.1,100.08 v31.75,100.08 | v38.23,12.83 38.86,12.19 | v37.21,13.84 35.05,13.84 30.99,17.91 13.97,17.91 | 44.83,80.01 44.96,80.01 46.36,78.61 56.01,78.61 JP2.3 | 44.83,80.01 OP1POSGND6.1 | JP1.3 62.23,19.68 59.82,17.27 53.47,17.27 v51.31,15.11 | 44.83,80.01 44.83,84.45 45.59,85.22 45.59,86.23 v41.91,89.92 | v34.54,97.28 v38.86,92.96
  Bottom 0.381: v37.21,13.84 v38.23,12.83 | v51.31,15.11 48.9,12.7 D5.A | v38.86,92.96 v41.91,89.92 | v31.75,100.08 v34.54,97.28
A1
  Top 0.381: U$12.38 OP2TEST1.3 OP2TEST6.3
A2
  Top 0.381: U$12.37 OP2TEST1.2 OP2TEST6.2
A3
  Top 0.381: U$12.36 OP2TEST1.1 OP2TEST6.1
B1
  Top 0.381: U$12.30 OP2TEST2.3 OP2TEST7.3
B2
  Top 0.381: U$12.29 OP2TEST2.2 OP2TEST7.2
B3
  Top 0.381: U$12.28 OP2TEST2.1 OP2TEST7.1
C1
  Top 0.381: U$12.22 OP2TEST3.3 OP2TEST8.3
C2
  Top 0.381: U$12.21 OP2TEST3.2 OP2TEST8.2
C3
  Top 0.381: U$12.20 OP2TEST3.1 OP2TEST8.1
CV  (via drill 0.3)
  Top 0.381: U$9.14 45.09,1.78 45.09,4.19 U$9.13 45.09,4.45 v45.09,6.22 | JP17.1 JP16.1 JP15.1 53.21,20.19 53.21,19.3 50.55,16.64 v50.55,16.38 | v44.07,7.24 44.07,7.75 49.28,12.95 49.28,13.84 v49.15,13.97
  Bottom 0.381: v44.07,7.24 v45.09,6.22 | v49.15,13.97 50.67,15.49 50.67,16.26 v50.55,16.38
D1
  Top 0.381: U$12.14 OP2TEST4.3 OP2TEST9.3
D2
  Top 0.381: U$12.13 OP2TEST4.2 OP2TEST9.2
D3
  Top 0.381: U$12.12 OP2TEST4.1 OP2TEST9.1
E1
  Top 0.381: U$12.6 OP2TEST5.3 OP2TEST10.3
E2
  Top 0.381: U$12.5 OP2TEST5.2 OP2TEST10.2
E3
  Top 0.381: U$12.4 OP2TEST5.1 OP2TEST10.1
GATE  (via drill 0.3)
  Top 0.381: U$9.16 42.55,1.78 42.55,4.19 U$9.15 42.55,4.45 42.55,4.7 44.96,7.11 v49.02,7.11 | JP17.2 JP16.2 JP15.2 54.48,18.92 54.1,18.92 50.55,15.37 50.55,6.86 50.04,6.35 v50.04,6.1
  Bottom 0.381: v50.04,6.1 v49.02,7.11
GND  (via drill 0.3)
  Top 0.381: C13.1 v32.77,10.16 C12.1 | OP2POSGND.2 53.72,86.23 52.71,86.23 OP2NEGGND.2 52.71,86.36 v52.71,87.38 | OP1POSGND.1 25.27,86.23 24.26,86.23 OP1NEGGND.2 24.13,86.36 v24.13,87.38 | v30.48,0.89 D1.- | v34.29,0.89 D2.+ | v38.1,0.89 D3.- | v60.2,33.02 C15.1 | v19.05,87.25 19.94,87.25 R20.2 | v30.48,87.25 29.59,87.25 R19.2 | v47.5,87.25 48.39,87.25 R22.2 | v58.93,87.25 58.04,87.25 R21.2 | v38.23,10.16 C9.+ | v31.75,14.22 C11.- C10.- | v34.8,81.41 33.78,82.42 C7.- | v44.83,85.47 43.82,85.47 C8.+ | v43.43,14.1 C14.1 | v41.53,86.11 C6.2 | v32.51,87.38 33.66,87.38 C5.1 | v62.61,39.5 61.85,38.74 U2.4 | v57.4,48.26 JP18.6
  pour Bottom: 0,101.6 60.96,101.6 arc-90 63.5,99.06 63.5,0 0,0
LA1
  Top 0.381: U$12.33 JP7.1 JP12.1
LA2
  Top 0.381: U$12.34 JP7.2 JP12.2
LB1
  Top 0.381: U$12.25 JP6.1 JP11.1
LB2
  Top 0.381: U$12.26 JP6.2 JP11.2
LC1
  Top 0.381: U$12.17 JP5.1 JP10.1
LC2
  Top 0.381: U$12.18 JP5.2 JP10.2
LD1
  Top 0.381: U$12.9 JP4.1 JP9.1
LD2
  Top 0.381: U$12.10 JP4.2 JP9.2
LE1
  Top 0.381: U$12.1 JP3.1 JP8.1
LE2
  Top 0.381: U$12.2 JP3.2 JP8.2
MOSI  (via drill 0.3)
  Top 0.381: JP13.1 52.71,38.74 U2.5 55.37,38.74 55.5,38.86 56.77,38.86 v59.31,41.4 | v60.96,43.82 JP18.4
  Bottom 0.381: v60.96,43.82 60.96,43.05 v59.31,41.4
N$1
  Top 0.381: R9.2 26.67,82.93 26.67,81.28 26.16,80.77 OP1POS.3
N$2
  Top 0.381: OP1TOOP2NEG.1 39.5,94.36 39.5,96.14 OP1TOOP2POS.1 39.37,96.39 36.58,99.19 OUTPUTS.1 37.21,99.31 34.04,99.31 R6.1
N$3
  Top 0.381: R8.2 28.7,82.93 28.7,80.77 OP1POS.2
N$4
  Top 0.381: R5.1 46.86,99.31 42.42,99.31 OUTPUTS.3
N$5
  Top 0.381: OP2TEST14.2 TM1.S OP2TEST11.2
N$6
  Top 0.381: OP2TEST13.2 TM2.S OP2TEST12.2
N$7
  Top 0.381: R7.2 30.73,82.93 30.73,81.15 31.11,80.77 OP1POS.1
N$8
  Top 0.381: R10.2 17.65,82.93 17.65,80.77 OP1NEG.3
N$9
  Top 0.381: R11.2 20.19,82.93 20.19,80.77 OP1NEG.2
N$10
  Top 0.381: R12.2 22.73,82.93 22.73,80.77 OP1NEG.1
N$11
  Top 0.381: R13.1 55.25,82.93 55.25,80.77 OP2POS.3
N$12
  Top 0.381: R14.1 57.79,82.93 57.79,80.77 OP2POS.2
N$13
  Top 0.381: R15.1 60.2,82.93 60.2,80.77 OP2POS.1
N$14
  Top 0.381: R16.1 46.23,82.93 46.23,80.77 OP2NEG.3
N$15
  Top 0.381: R17.1 48.77,82.93 48.77,80.77 OP2NEG.2
N$16
  Top 0.381: R18.1 51.18,82.93 51.18,80.77 OP2NEG.1
N$17
  Top 0.381: OP2TEST12.1 19.05,11.43 TM2.E 19.18,11.43 OP2TEST13.1
N$18
  Top 0.381: R25.2 D3.+
N$19
  Top 0.381: R23.2 D1.+
N$20
  Top 0.381: R24.1 D2.-
N$21
  Top 0.381: OP2TEST12.3 19.05,16.51 TM2.A 19.18,16.51 OP2TEST13.3
N$22
  Top 0.381: OP2TEST11.1 19.05,1.27 TM1.E 19.18,1.27 OP2TEST14.1
N$23
  Top 0.381: OP2TEST11.3 19.05,6.35 TM1.A 19.18,6.35 OP2TEST14.3
N$24
  Top 0.381: OP2TEST18.2 TM3.S OP2TEST15.2
N$25
  Top 0.381: OP2TEST16.2 TM4.S OP2TEST17.2
N$26
  Top 0.381: OP2TEST17.1 54.61,62.23 TM4.E 54.74,62.23 OP2TEST16.1
N$27
  Top 0.381: OP2TEST17.3 54.61,67.31 TM4.A | 54.48,67.44 TM4.A | OP2TEST16.3 54.74,67.31 TM4.A
N$28
  Top 0.381: OP2TEST15.1 54.61,52.07 TM3.E 54.74,52.07 OP2TEST18.1
N$29
  Top 0.381: OP2TEST15.3 54.61,57.15 TM3.A 54.74,57.15 OP2TEST18.3
N$30
  Top 0.381: U$9.10 50.16,1.78 50.16,4.19 U$9.9 50.16,4.45 53.98,8.26 D4.A
N$31
  Top 0.381: U$9.2 60.33,1.78 60.33,4.19 U$9.1 60.33,4.45 55.88,8.89 D5.C
N$32  (via drill 0.3)
  Top 0.381: U$9.12 47.62,1.78 47.62,4.19 U$9.11 47.62,4.45 47.62,4.7 49.91,6.98 v49.91,15.75 | D6.A 41.91,15.88 43.31,17.27 48.39,17.27 v48.9,16.76
  Bottom 0.381: v49.91,15.75 v48.9,16.76
OP1NEG  (via drill 0.3)
  Top 0.381: R10.1 17.78,84.58 20.19,84.58 R11.1 20.32,84.58 21.46,84.58 | 21.46,84.58 22.61,84.58 R12.1 | 21.46,84.58 21.46,86.23 | 21.46,86.23 21.46,87.12 R20.1 21.46,87.38 21.46,94.49 OP1TEST.1 | 21.46,86.23 23.24,86.23 OP1NEGGND.1 | C3.1 17.27,92.46 19.18,92.46 R2.2 19.3,92.58 22.61,95.88 22.73,95.88 | 22.73,95.88 22.73,95.12 22.35,94.74 OP1TEST.1 | 22.73,95.88 22.73,96.65 OP1POSGND2.1 | v36.58,87.12 37.08,86.61 37.08,85.47 IC1.2 | v34.16,86.36 32.51,86.36 25.53,93.34 24.26,93.34 22.73,94.87 OP1TEST.1
  Bottom 0.381: v36.58,87.12 35.81,86.36 v34.16,86.36
OP1OUT
  Top 0.381: R1.1 30.73,92.46 32.64,92.46 C4.2 | C4.2 32.89,92.33 35.18,90.04 35.18,88.39 35.81,87.76 35.81,85.47 IC1.1 | C3.2 17.27,94.11 19.18,94.11 R2.1 19.3,94.23 19.3,94.74 22.35,97.79 25.15,97.79 25.27,97.66 | 27.18,97.28 26.67,96.77 OP1POSGND1.2 | 27.18,97.28 27.56,97.66 | 27.56,97.66 29.08,99.19 32.38,99.19 R6.2 32.51,99.06 33.78,97.79 33.78,93.47 33.02,92.71 33.02,92.46 C4.2 | 25.27,97.66 25.4,97.79 27.43,97.79 27.56,97.66 | 25.27,97.66 24.38,96.77 23.75,96.77 OP1POSGND2.2 | OP1TEST.3 27.3,97.16 27.18,97.28
OP1POS  (via drill 0.3)
  Top 0.381: C4.1 32.64,94.11 30.73,94.11 R1.2 30.61,93.98 28.45,93.98 27.81,93.34 26.8,93.34 | OP1POSGND1.1 25.78,96.65 25.78,95.63 24.89,94.74 OP1TEST.2 25.27,94.87 26.8,93.34 | 27.94,84.58 28.7,84.58 R8.1 28.83,84.58 30.61,84.58 R7.1 30.86,84.45 31.37,83.95 34.04,83.95 v35.43,82.55 | 27.94,84.58 26.8,84.58 R9.1 | 27.94,84.58 27.94,86.23 | 27.94,86.23 27.94,87.12 R19.1 27.94,87.38 25.65,89.66 v25.65,92.2 | 27.94,86.23 26.16,86.23 OP1POSGND.2 | v36.45,83.57 37.21,83.57 38.35,84.71 38.35,85.34 IC1.3 | v26.67,93.22 26.8,93.34
  Bottom 0.381: v35.43,82.55 v36.45,83.57 | v25.65,92.2 v26.67,93.22
OP2NEG  (via drill 0.3)
  Top 0.381: R16.2 46.36,84.58 48.64,84.58 R17.2 48.9,84.58 50.04,84.58 | 50.04,84.58 51.18,84.58 R18.2 | 50.04,84.58 50.04,86.23 | 50.04,86.23 50.04,87.12 R22.1 49.91,87.38 45.34,91.95 C2.1 | 50.04,86.23 OP2NEGGND.1 | 40.51,93.47 38.48,91.44 38.48,90.68 IC1.6 | 40.51,93.47 40.89,93.85 40.89,94.23 OP1TOOP2NEG.2 | C2.1 45.85,92.46 47.62,92.46 R4.2 47.88,92.58 51.18,95.88 51.31,95.88 | 51.31,95.88 51.31,95.38 50.67,94.74 OP2TEST.3 | 51.31,95.88 51.31,96.65 OP1POSGND4.1 | v40.89,93.09 40.51,93.47 | v42.29,91.69 44.96,91.69 45.59,92.33 C2.1
  Bottom 0.381: v42.29,91.69 v40.89,93.09
OP2OUT
  Top 0.381: C1.2 60.71,94.11 58.8,94.11 R3.1 58.67,94.23 58.67,94.74 55.63,97.79 54.74,97.79 53.85,96.9 53.85,96.77 | 53.85,96.77 54.23,96.77 OP1POSGND3.2 | 53.85,96.77 53.21,96.77 | 53.21,96.77 52.2,96.77 OP1POSGND4.2 52.07,96.9 52.07,97.54 51.82,97.79 48.39,97.79 | 53.21,96.77 53.21,94.74 OP2TEST.2 | 48.39,97.79 48.39,94.87 47.75,94.23 R4.1 47.62,94.11 45.85,94.11 C2.2 45.59,94.11 43.69,94.11 41.53,91.95 41.53,90.55 40.01,89.03 37.97,89.03 37.21,89.79 37.21,90.55 IC1.7 | 48.39,97.79 48.39,99.19 R5.2
OP2POS  (via drill 0.3)
  Top 0.381: 41.78,94.87 41.02,95.63 41.02,96.14 OP1TOOP2POS.2 | 41.78,94.87 41.78,92.96 39.75,90.93 39.75,90.68 IC1.5 | 56.52,84.58 57.66,84.58 R14.2 57.91,84.58 60.2,84.58 R15.2 | 56.52,84.58 55.25,84.58 R13.2 | 56.52,84.58 56.52,86.23 | 56.52,86.23 56.52,87.12 R21.1 56.52,87.38 56.52,93.09 | 56.52,86.23 54.74,86.23 OP2POSGND.1 | C1.1 60.71,92.46 58.8,92.46 R3.2 58.55,92.46 55.37,95.63 OP2TEST.1 | OP1POSGND3.1 55.25,96.65 55.25,95.12 55.63,94.74 OP2TEST.1 | 56.52,93.09 56.52,94.23 OP2TEST.1 | v47.5,95 41.91,95 41.78,94.87 | 56.52,93.09 v49.4,93.09
  Bottom 0.381: v49.4,93.09 v47.5,95
RST  (via drill 0.3)
  Top 0.381: v57.53,29.34 61.59,33.4 | 61.59,33.4 61.72,33.53 61.72,34.93 U2.1 | v56.01,29.34 54.74,29.34 JP13.6 | v57.15,41.28 JP18.5 | v58.67,36.83 v58.67,39.75 | 61.59,33.4 v59.44,35.56
  Bottom 0.381: v56.01,29.34 v57.53,29.34 | v58.67,39.75 v57.15,41.28 | v58.67,36.83 58.67,36.32 v59.44,35.56
VNEG
  Top 0.381: OP1POSGND6.2 42.04,80.01 41.4,80.64 POWER.3 41.53,80.77 42.8,82.04 | 42.8,82.04 43.69,82.93 C8.- | 42.8,82.04 C6.1 41.4,83.31 39.75,84.96 39.75,85.34 IC1.4
VPOS  (via drill 0.3)
  Top 0.381: 34.8,84.2 36.2,82.8 36.2,80.77 POWER.1 36.07,80.64 35.43,80.01 OP1POSGND5.1 | 34.8,84.2 34.04,84.96 33.78,84.96 C7.+ | 34.8,84.2 34.92,84.33 34.92,87.88 33.78,89.03 C5.2 34.04,89.03 v34.04,90.17 | v35.05,91.19 35.56,90.68 35.81,90.68 IC1.8
  Bottom 0.381: v34.04,90.17 v35.05,91.19

### Text on the board
tPlace: + | - | + | - | + | - | + | - | + | - | + | - | + | - | + | - | + | - | + | + | - | + | - | - | + | - | + | - | + | - | + | - | + | - | + | - | + | - | + | - | + | - | + | - | + | - | + | - | + | - | + | - | + | - | + | - | + | + | - | + | - | - | + | - | + | - | 5V | 5V | CV | CV | + | - | + | - | GT | GT | + | - | + | - | + | - | + | - | + | - | + | -
bPlace: Vin | Vin | Vin | noninverting amplifier | inverting amplifier | voltage follower | Vout / Vin = 1 + R2 / R1 | Vout / Vin = -R2 / R1 | Vout | Vout = Vin | Vout | Vout